# EAGLE design WaterE_mac (EAGLE 9.6.2)
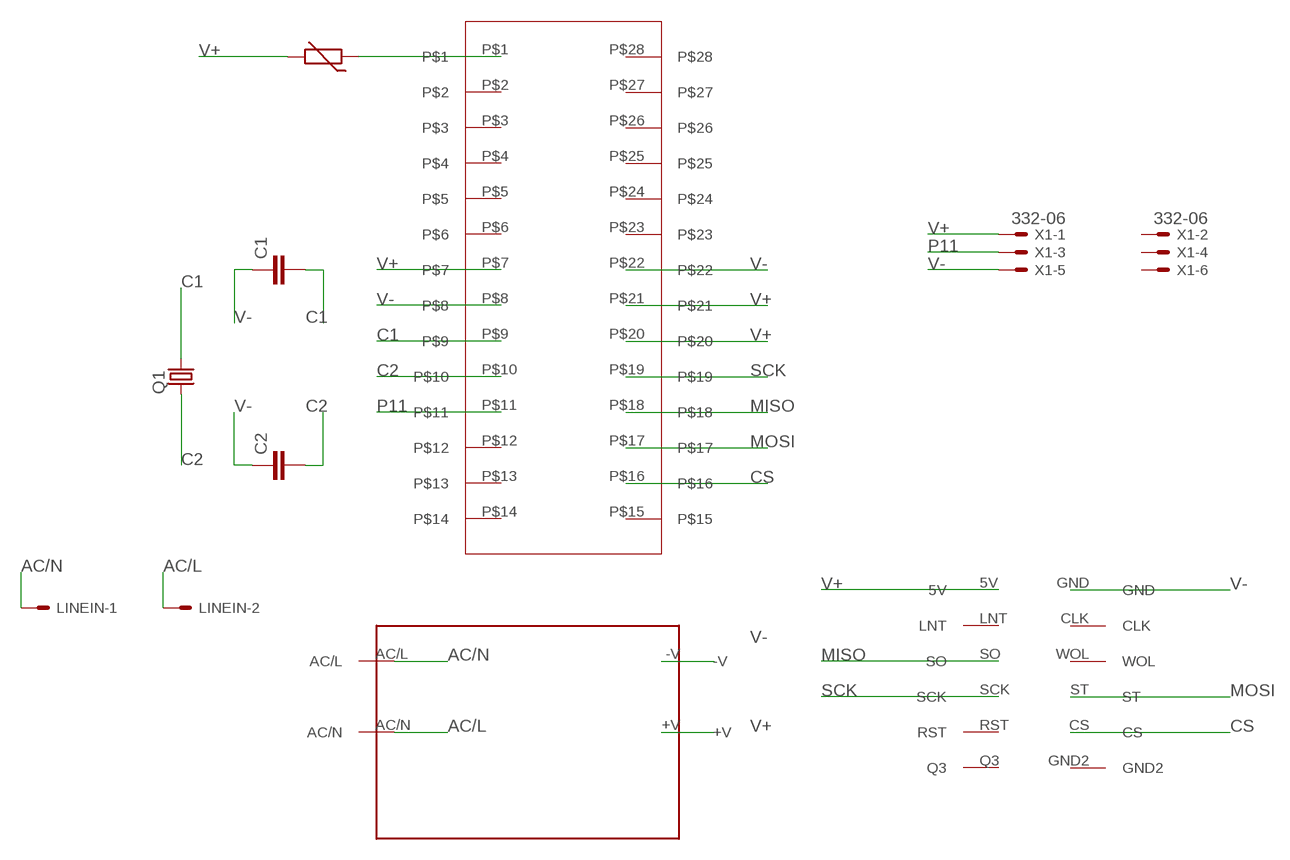
[diagram p0: schematic, sheet 1]

## Parts
C1  C-EU025-024X044  [C025-024X044]
C2  C-EU025-024X044  [C025-024X044]
LINEIN  AC/L  332-02  [332-02]
Q1  CRYSTALTC26V  [TC26V]
R1  THERMISTOR_R-5  [R-5]
U$1  POWER_COMPONENT  [POWER_COMPONENT]
U$2  ETHER  [ETHER]
U$4  SOCKET_SENIOR  [SOCKET_SENIOR]
X1  332-06  [332-06]

## Nets
AC/L: LINEIN.2 U$1.AC/N
AC/N: LINEIN.1 U$1.AC/L
C1: C1.2 Q1.2 U$4.P$9
C2: C2.2 Q1.1 U$4.P$10
CS: U$2.CS U$4.P$16
MISO: U$2.SO U$4.P$18
MOSI: U$2.ST U$4.P$17
N$1: R1.1 U$4.P$1
P11: U$4.P$11 X1.3
SCK: U$2.SCK U$4.P$19
V+: R1.2 U$1.+V U$2.5V U$4.P$7 U$4.P$20 U$4.P$21 X1.1
V-: C1.1 C2.1 U$1.-V U$2.GND U$4.P$8 U$4.P$22 X1.5
Unconnected: U$2.CLK U$2.GND2 U$2.LNT U$2.Q3 U$2.RST U$2.WOL U$4.P$2 U$4.P$3 U$4.P$4 U$4.P$5 U$4.P$6 U$4.P$12 U$4.P$13 U$4.P$14 U$4.P$15 U$4.P$23 U$4.P$24 U$4.P$25 U$4.P$26 U$4.P$27 U$4.P$28 X1.2 X1.4 X1.6

## Library data of the parts
C1 C2 = rcl:C-EU: CAPACITOR, European symbol
LINEIN = con-garry:332-02: 2 Pin - 2mm Dual Row Source: www.mpe-connector.de / garry_shortform_2012.pdf
Q1 = crystal:CRYSTAL: CRYSTAL; OC_FARNELL: unknown; OC_NEWARK: unknown
R1 = discrete:THERMISTOR_: Thermo Resistor
U$1 = AC_DC_Component:POWER_COMPONENT
U$2 = Ether:ETHER
U$4 = socket:SOCKET_SENIOR: CUSTOMIZE SOCKET FOR ATMEGA FOR MY SENIOR PROJECT
X1 = con-garry:332-06: 6 Pin - 2mm Dual Row Source: www.mpe-connector.de / garry_shortform_2012.pdf

## Board
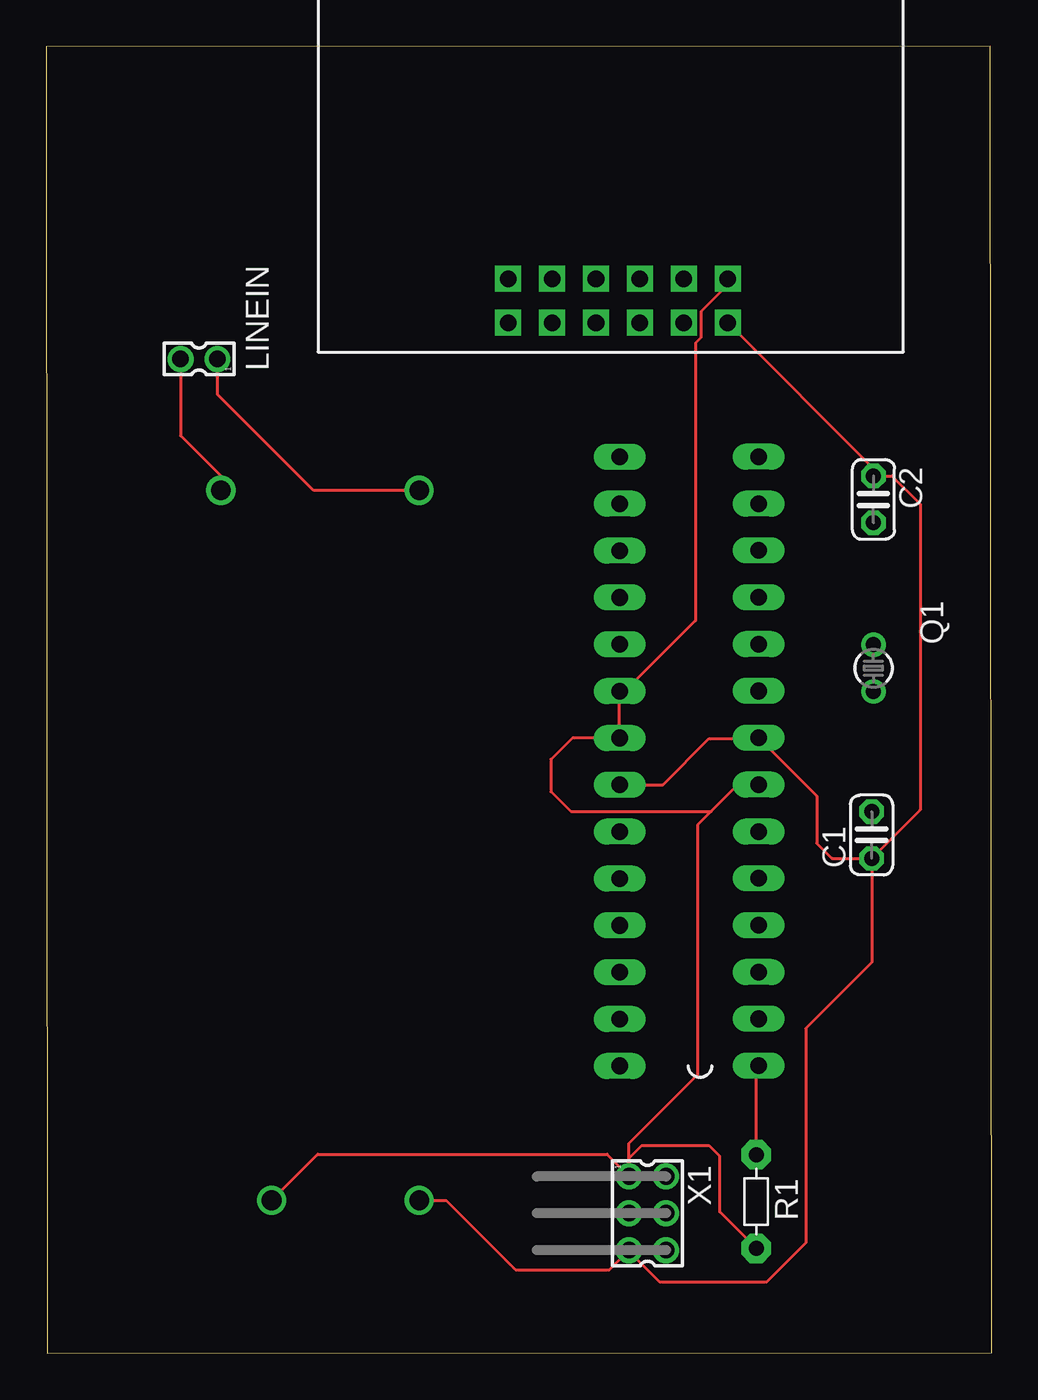
[diagram p1: board, top side]
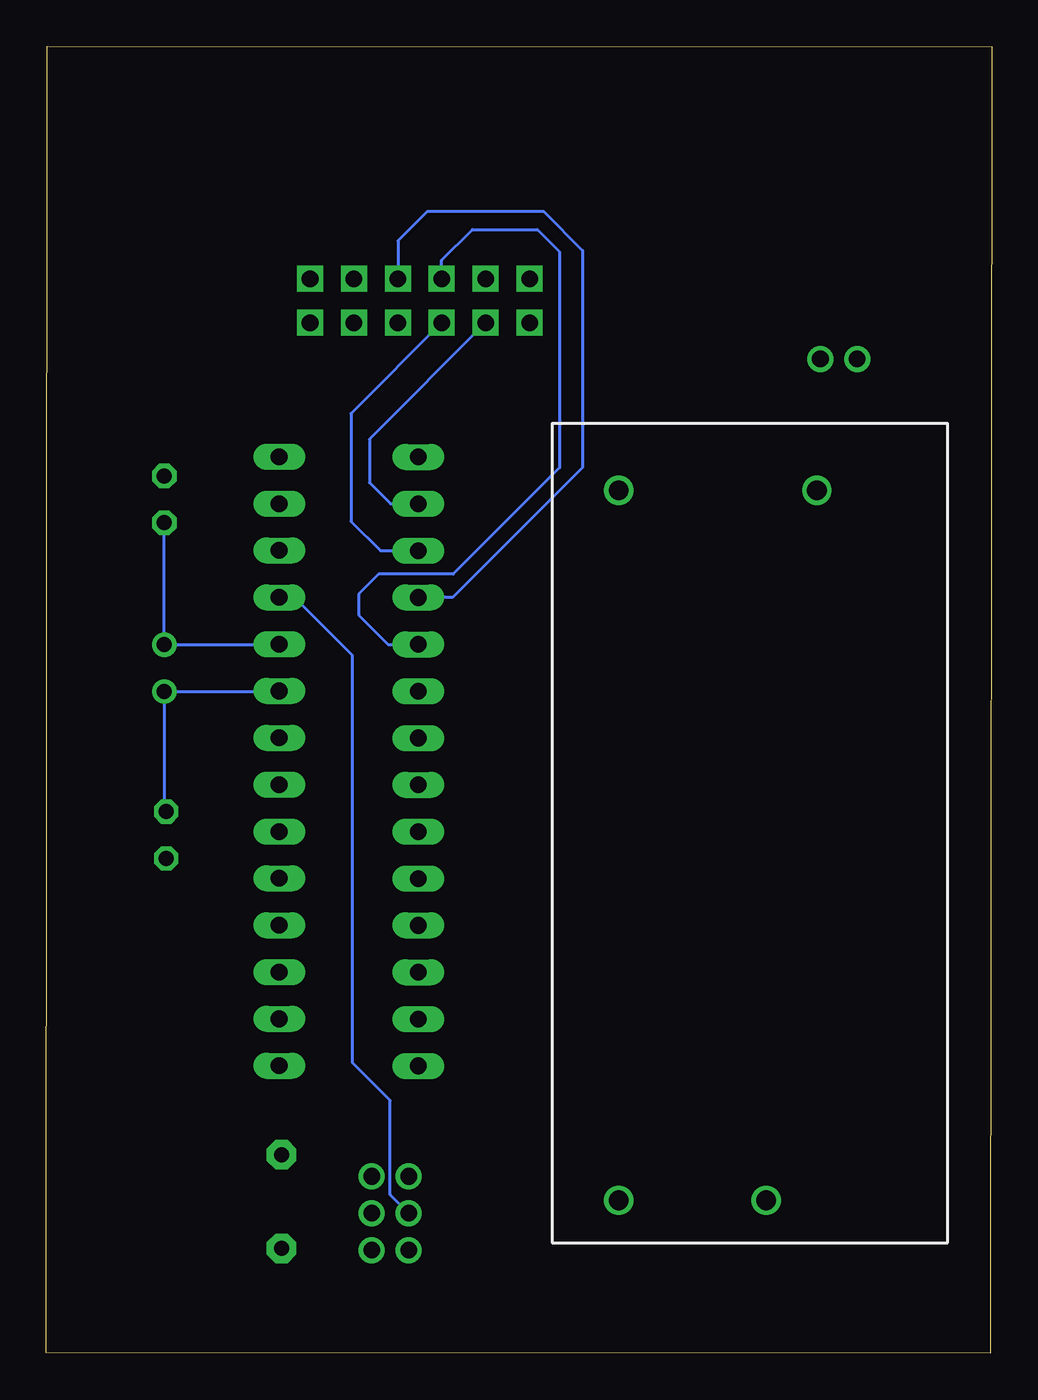
[diagram p2: board, bottom side, seen from below]

Size 51.28 x 70.89 mm. Coordinates in mm from the lower left corner, seen from the top.
Outline: 0.07,0 51.28,0.04 51.21,70.89 0,70.85 0.07,0
Copper layers (1*16): Top 0.035mm / dielectric 1.5mm / Bottom 0.035mm
Design rules "default": minimum track width 6mil, minimum drill 0.35mm, track to track 6mil, track to pad 6mil, pad to pad 6mil, via to via 6mil, smd to smd 6mil, copper to edge 40mil, drill to drill 6mil, minimum pad ring 10mil, minimum via ring 8mil, stop-mask expansion 4mil, vias tented up to drill 0mil, thermal gap 10mil

### Footprints (pad centres in the part's own frame; a part is rotated, then mirrored left to right if it is on the bottom)
C025-024X044 = drill 0.813 octagon: 1 -1.27,0; 2 1.27,0
332-02 = drill 0.9 pad 1.27: 1 0,-1; 2 0,1
TC26V = drill 0.813: 1 -1.27,0; 2 1.27,0
R-5 = drill 0.813 pad 1.6 octagon: 1 -2.54,0; 2 2.54,0
POWER_COMPONENT = drill 1.06: +V 8,-38.5; -V 0,-38.5; AC/L 0,0; AC/N 10.75,0
ETHER = drill 0.9 square: 5V 9.525,-3.969; CLK 11.906,-1.587; CS 19.05,-1.587; GND 9.525,-1.587; GND2 21.431,-1.587; LNT 11.906,-3.969; Q3 21.431,-3.969; RST 19.05,-3.969; SCK 16.669,-3.969; SO 14.287,-3.969; ST 16.669,-1.587; WOL 14.287,-1.587
SOCKET_SENIOR = drill 0.9 pad 1.27 long: P$1 0,33.02; P$2 0,30.48; P$3 0,27.94; P$4 0,25.4; P$5 0,22.86; P$6 0,20.32; P$7 0,17.78; P$8 0,15.24; P$9 0,12.7; P$10 0,10.16; P$11 0,7.62; P$12 0,5.08; P$13 0,2.54; P$14 0,0; P$15 7.54,0.01; P$16 7.54,2.55; P$17 7.54,5.09; P$18 7.54,7.63; P$19 7.54,10.17; P$20 7.54,12.71; P$21 7.54,15.25; P$22 7.54,17.79; P$23 7.54,20.33; P$24 7.54,22.87; P$25 7.54,25.41; P$26 7.54,27.95; P$27 7.54,30.49; P$28 7.54,33.03
332-06 = drill 0.9 pad 1.27: 1 -2,-1; 2 -2,1; 3 0,-1; 4 0,1; 5 2,-1; 6 2,1

### Placement (x,y rotation side)
C1  44.77,28.11 90 top
C2  44.87,46.31 270 top
LINEIN  8.29,53.92 90 top
Q1  44.87,37.16 270 top
R1  38.51,8.23 270 top
U$1  20.23,46.8 0 bottom
U$2  46.49,54.3 180 top
U$4  38.64,48.62 180 top
X1  32.62,7.6 270 top

### Tracks (layer width: path | path; a pad name or v marks a point on that pad's centre or on a via)
AC/L
  Top 0.152: LINEIN.2 7.29,49.76 9.48,47.57 U$1.AC/N
AC/N
  Top 0.152: LINEIN.1 9.29,52.03 14.52,46.8 U$1.AC/L
C1
  Bottom 0.152: U$4.P$9 38.67,35.89 Q1.2 44.87,29.48 C1.2
C2
  Bottom 0.152: U$4.P$10 38.67,38.43 Q1.1 C2.2
CS
  Bottom 0.152: U$2.CS 33.75,49.58 33.75,47.21 32.61,46.07 U$4.P$16
MISO
  Bottom 0.152: U$4.P$18 29.23,40.99 22.18,48.04 22.18,59.81 24.27,61.9 30.63,61.9 32.2,60.33 U$2.SO
MOSI
  Bottom 0.152: U$2.ST 34.74,50.97 34.74,45.12 33.15,43.53 U$4.P$17
N$1
  Top 0.152: R1.1 38.51,15.47 U$4.P$1
P11
  Bottom 0.152: X1.3 32.62,8.6 32.62,13.72 34.66,15.76 34.66,37.85 37.81,41 U$4.P$11
SCK
  Bottom 0.152: U$2.SCK 29.82,59.28 28.16,60.94 24.63,60.94 23.43,59.74 23.43,48.03 29.2,42.26 33.24,42.26 34.33,41.17 34.33,40.04 32.74,38.45 U$4.P$19
V+
  Top 0.152: U$1.+V 14.73,10.8 30.42,10.8 X1.1 | R1.2 36.53,7.67 36.53,10.69 35.96,11.26 32.3,11.26 31.62,10.58 X1.1 | X1.1 31.62,11.4 35.35,15.13 35.35,28.67 36.06,29.38 | 36.06,29.38 37.52,30.84 U$4.P$7 | 36.06,29.38 28.47,29.38 27.38,30.47 27.38,32.21 28.54,33.37 U$4.P$21 31.1,35.83 | 31.1,35.83 U$4.P$20 | U$2.5V 36.97,57.94 35.52,56.5 35.52,55.09 35.22,54.79 35.22,39.73 31.32,35.83 31.1,35.83
  Bottom 0.152: 38.06,30.84 U$4.P$7
V-
  Top 0.152: U$1.-V 21.69,8.3 25.47,4.52 30.54,4.52 31.59,5.57 | 31.59,5.57 X1.5 | U$4.P$8 38.68,33.34 | 38.68,33.34 41.8,30.22 41.8,27.66 42.62,26.84 C1.1 | C1.1 47.4,29.47 47.4,46.05 45.87,47.58 C2.1 44.87,47.98 U$2.GND | U$4.P$22 33.44,30.83 35.95,33.34 38.68,33.34 | C1.1 44.77,21.19 41.2,17.62 41.2,5.99 39.07,3.86 33.29,3.86 31.59,5.57
  Bottom 0.152: 29.99,30.83 U$4.P$22